# Altium project 0020-03_FFT2G.PrjPcb (part 5 of 5)

## Sheet [3] ADC_INPUT_BIAS.SchDoc: ADC Input Bias
size 299 x 210 mm; SheetNumber: 3; SheetTotal: 21; PageSetup: Record=PageOptions|CenterHorizontal=True|CenterVertical=True|PrintScale=0.94|XCorrection=0.00|YCorrection=0.00|PrintKind=0|BorderSize=5000000|LeftOffset=0|BottomOffset=0|Orientation=2|PaperLength=1000|PaperWidth=1000|Scale=100|PaperSource=15|PrintQuality=600|MediaType=1|DitherType=10|PrintScaleMode=1|PaperKind=A4; Adr1: August Barks gata 6B; Adr2: SE-421 32 Västra Frölunda; Adr3: Sweden; Webpage: www.omnisys.se
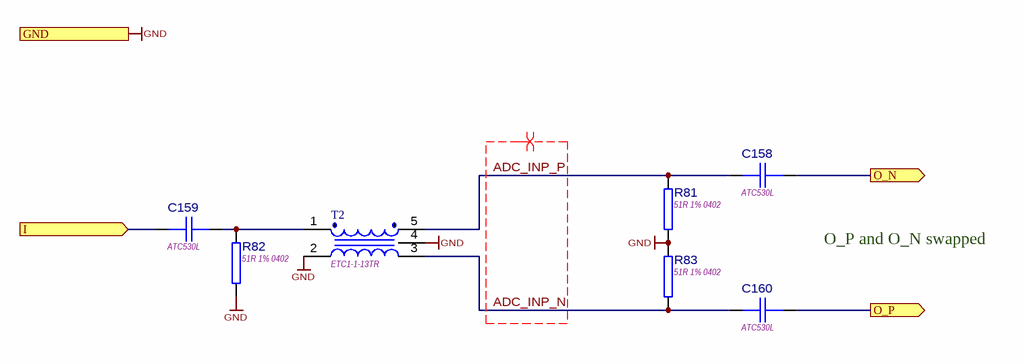
[diagram p13: [3] ADC_INPUT_BIAS.SchDoc]

### Parts
C158  ATC530L  [CAPC1005X06L]
C159  ATC530L  [CAPC1005X06L]
C160  ATC530L  [CAPC1005X06L]
R81  51R 1% 0402  [RESC1005L]
R82  51R 1% 0402  [RESC1005L]
R83  51R 1% 0402  [RESC1005L]
T2  ETC1-1-13TR  [SOTFL50P160X73-3N]

### Ports
GND, I (in), O_N (out), O_P (out)

### Nets
GND: R81.1 R82.2 R83.2 T2.2(Primary) T2.4(NC) ; port GND
ADC_INP_N: C160.2 R83.1 T2.3(Secondary)
ADC_INP_P: C158.2 R81.2 T2.5(Secondary_dot)
NetC158_1: C158.1 ; port O_N
NetC159_1: C159.1 R82.1 T2.1(Primary_dot)
NetC159_2: C159.2 ; port I
NetC160_1: C160.1 ; port O_P

### Layout directives
differential pair; rule Differential Pairs Routing [Pref Gap = 0.2mm    Min Gap  = 0.2mm    Max Gap  = 0.2mmPref Width = 0.3mm    Min Width  = 0.3mm    Max Width  = 0.3mm]; net class DiffPairs_Input: ADC_INP_N, ADC_INP_P

### Notes on the sheet
- O_P and O_N swapped
- August Barks gata 6B
- Omnisys Instruments AB
- Title:
- PCB ASY:
- PCB:
- SVN:
- SVN Folder:
- SE-421 32 Västra Frölunda
- www.omnisys.se
- Page:
- of
- Print date:
- Page size:
- A4
- Information contained in this drawing is confidential. Copying, distributing or use in any matter, other than that specified by OMNISYS INSTRUMENTS AB, is strictly prohibited.

### Library data of the parts
C158-C160 = CMP-0300-000000-2: 100n 16V ±15% 0402 (1005 metric) ATC530L104KT16T; Case-EIA: 0402; Case-Metric: 1005; Dielectric: X7R; OmnisysBuy: False; Maximum working voltage: 16V; Tolerance: ±15%; Technology: SMT
R81-R83 = CMP-1800-001397-4: Thick film Chip Resistor, 0402/1005; Value: 51; Power: 100mW; Maximum working voltage: 50V; Temp. Coefficent: 0.01%; Tolerance: 1%; Case/Package: 0402/1005; Composition: Thick film
T2 = CMP-2000-000004-1: Transformers Audio & Signal 4.5-3000MHz IL 2dB Impedance Ratio 1:1; Max DC Current: 30mA; Power Rating: 250mW; Case/Package: SMD/SMT; Package Quantity: 2000; Termination: SMD/SMT; Depth: 3.81mm; Max Operating Temperature: 85°C; Turns Ratio: 1:1; Length: 3.81mm; Width: 3.81mm; Radiation Hardening: No; Packaging: Tape and Reel; Min Operating Temperature: -40°C; Mount: Surface Mount; Number of Pins: 5; Height: 2.67mm; Lead Free: Contains Lead

## Sheet [4] ADC_DECOUPLING.SchDoc: ADC Decoupling
size 393 x 281 mm; SheetNumber: 4; SheetTotal: 21; PageSetup: Record=PageOptions|CenterHorizontal=True|CenterVertical=True|PrintScale=0.94|XCorrection=0.00|YCorrection=0.00|PrintKind=0|BorderSize=5000000|LeftOffset=0|BottomOffset=0|Orientation=2|PaperLength=1000|PaperWidth=1000|Scale=100|PaperSource=15|PrintQuality=600|MediaType=1|DitherType=10|PrintScaleMode=1|PaperKind=A4; Adr1: August Barks gata 6B; Adr2: SE-421 32 Västra Frölunda; Adr3: Sweden; Webpage: www.omnisys.se
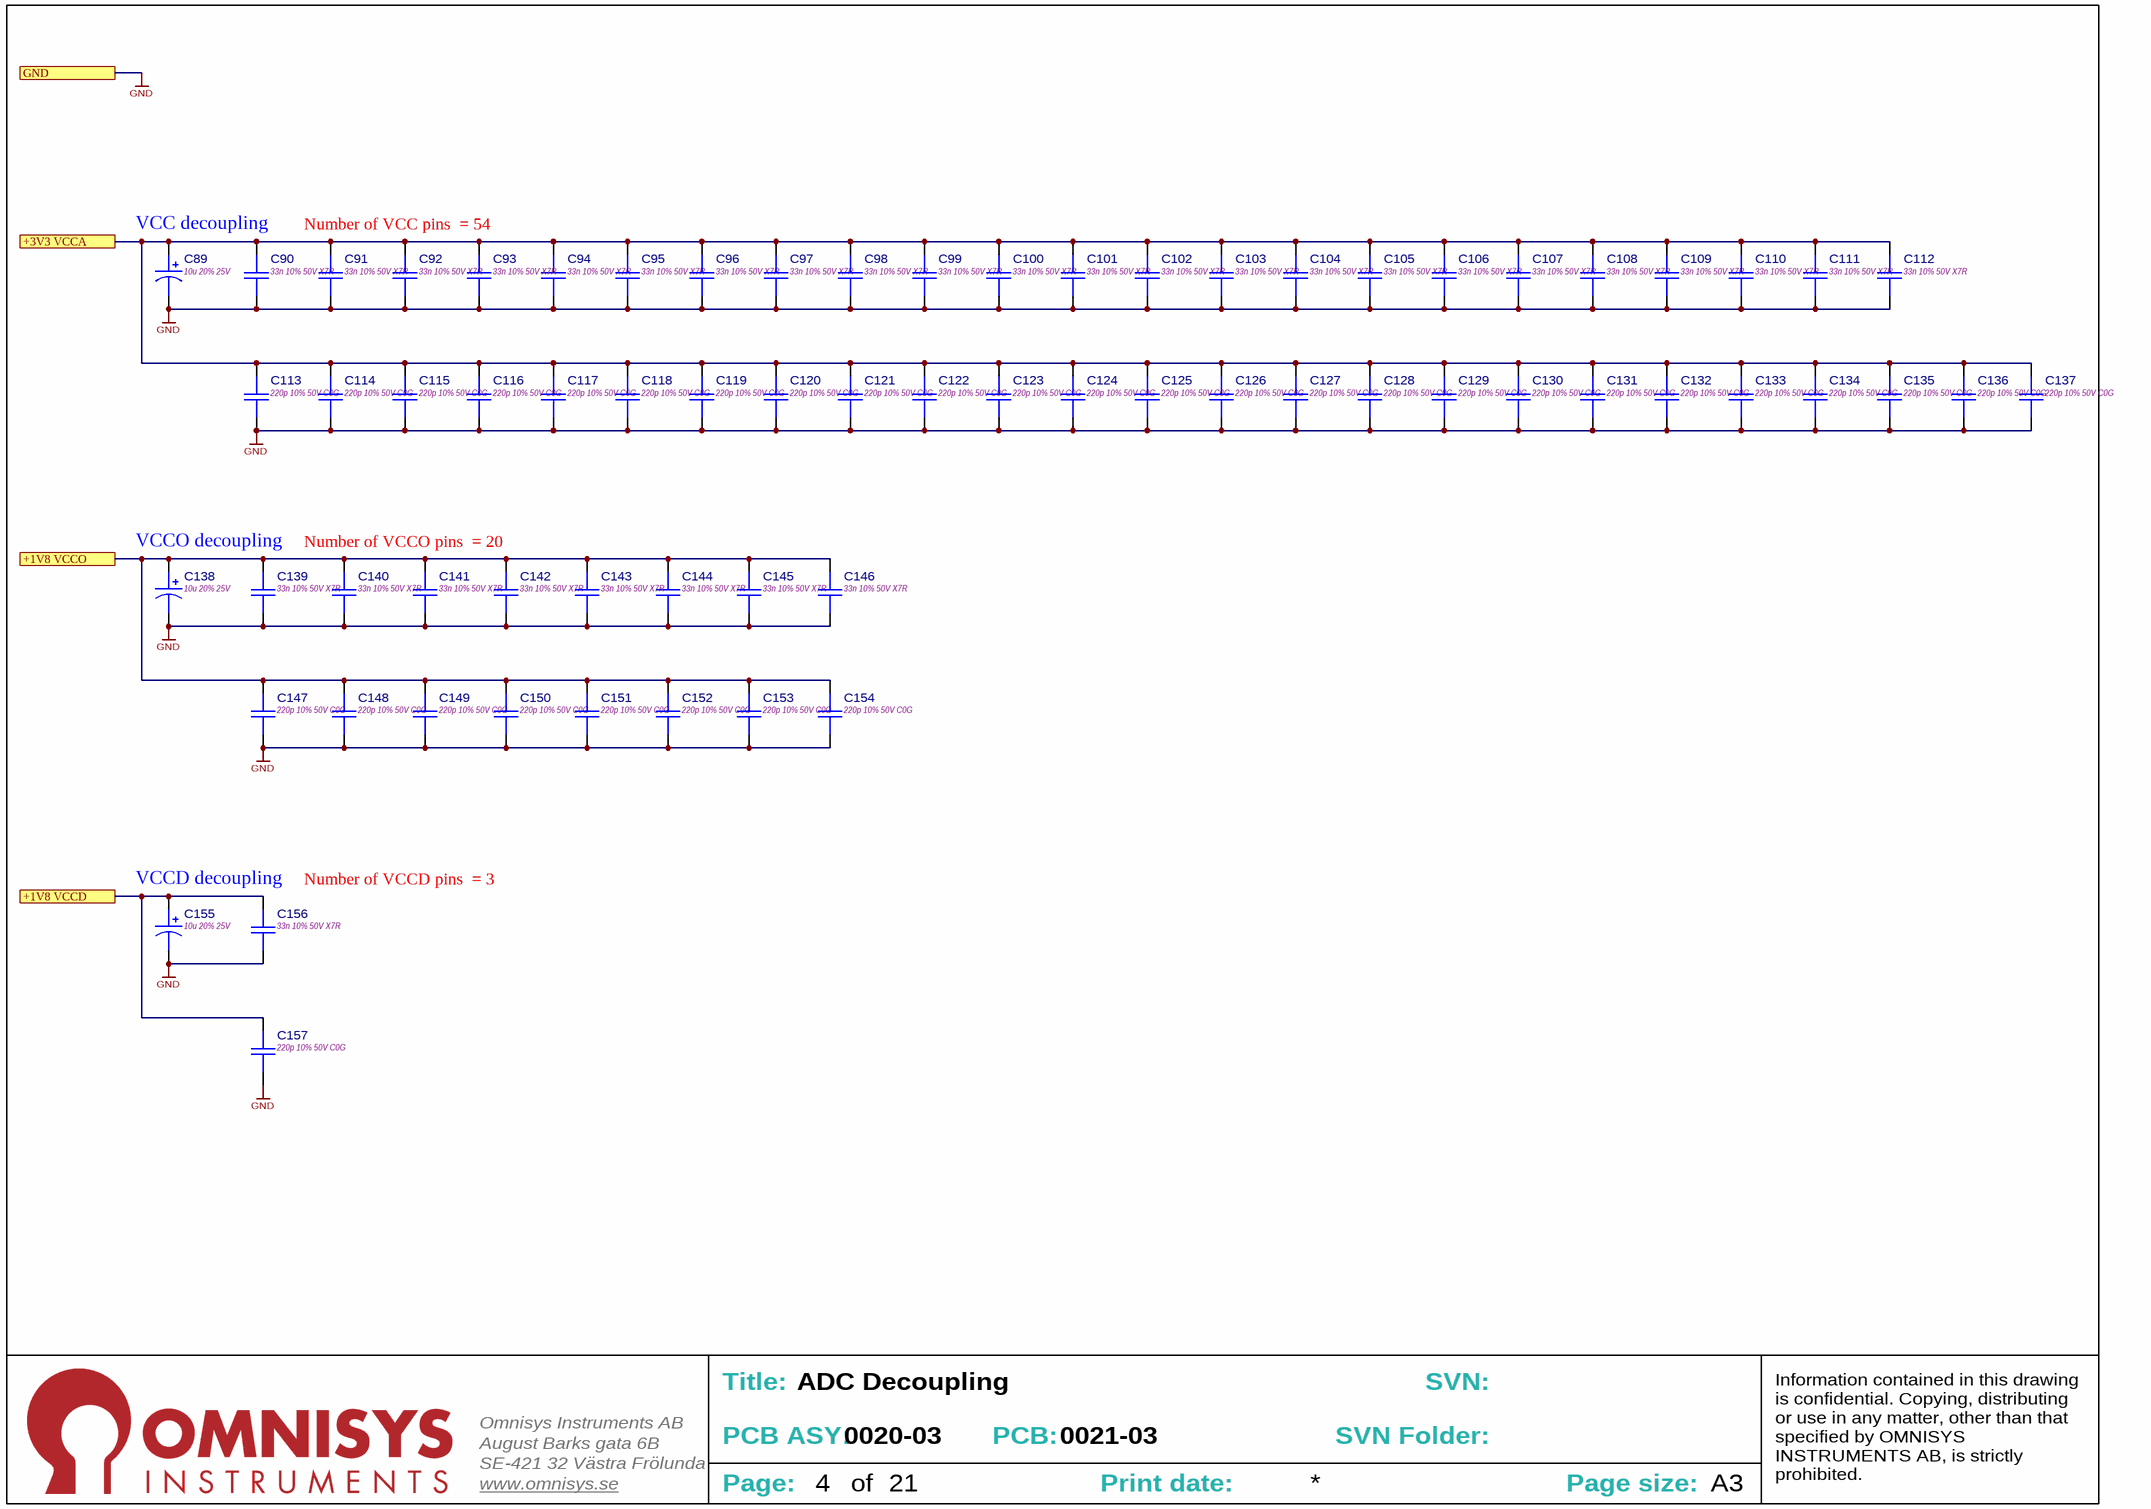
[diagram p14: [4] ADC_DECOUPLING.SchDoc]

### Parts
C89  10u 20% 25V  [CAPMP3528X21N]
C90  33n 10% 50V X7R  [CAPC1005X55L]
C91  33n 10% 50V X7R  [CAPC1005X55L]
C92  33n 10% 50V X7R  [CAPC1005X55L]
C93  33n 10% 50V X7R  [CAPC1005X55L]
C94  33n 10% 50V X7R  [CAPC1005X55L]
C95  33n 10% 50V X7R  [CAPC1005X55L]
C96  33n 10% 50V X7R  [CAPC1005X55L]
C97  33n 10% 50V X7R  [CAPC1005X55L]
C98  33n 10% 50V X7R  [CAPC1005X55L]
C99  33n 10% 50V X7R  [CAPC1005X55L]
C100  33n 10% 50V X7R  [CAPC1005X55L]
C101  33n 10% 50V X7R  [CAPC1005X55L]
C102  33n 10% 50V X7R  [CAPC1005X55L]
C103  33n 10% 50V X7R  [CAPC1005X55L]
C104  33n 10% 50V X7R  [CAPC1005X55L]
C105  33n 10% 50V X7R  [CAPC1005X55L]
C106  33n 10% 50V X7R  [CAPC1005X55L]
C107  33n 10% 50V X7R  [CAPC1005X55L]
C108  33n 10% 50V X7R  [CAPC1005X55L]
C109  33n 10% 50V X7R  [CAPC1005X55L]
C110  33n 10% 50V X7R  [CAPC1005X55L]
C111  33n 10% 50V X7R  [CAPC1005X55L]
C112  33n 10% 50V X7R  [CAPC1005X55L]
C113  220p 10% 50V C0G  [CAPC1005X55L]
C114  220p 10% 50V C0G  [CAPC1005X55L]
C115  220p 10% 50V C0G  [CAPC1005X55L]
C116  220p 10% 50V C0G  [CAPC1005X55L]
C117  220p 10% 50V C0G  [CAPC1005X55L]
C118  220p 10% 50V C0G  [CAPC1005X55L]
C119  220p 10% 50V C0G  [CAPC1005X55L]
C120  220p 10% 50V C0G  [CAPC1005X55L]
C121  220p 10% 50V C0G  [CAPC1005X55L]
C122  220p 10% 50V C0G  [CAPC1005X55L]
C123  220p 10% 50V C0G  [CAPC1005X55L]
C124  220p 10% 50V C0G  [CAPC1005X55L]
C125  220p 10% 50V C0G  [CAPC1005X55L]
C126  220p 10% 50V C0G  [CAPC1005X55L]
C127  220p 10% 50V C0G  [CAPC1005X55L]
C128  220p 10% 50V C0G  [CAPC1005X55L]
C129  220p 10% 50V C0G  [CAPC1005X55L]
C130  220p 10% 50V C0G  [CAPC1005X55L]
C131  220p 10% 50V C0G  [CAPC1005X55L]
C132  220p 10% 50V C0G  [CAPC1005X55L]
C133  220p 10% 50V C0G  [CAPC1005X55L]
C134  220p 10% 50V C0G  [CAPC1005X55L]
C135  220p 10% 50V C0G  [CAPC1005X55L]
C136  220p 10% 50V C0G  [CAPC1005X55L]
C137  220p 10% 50V C0G  [CAPC1005X55L]
C138  10u 20% 25V  [CAPMP3528X21N]
C139  33n 10% 50V X7R  [CAPC1005X55N]
C140  33n 10% 50V X7R  [CAPC1005X55N]
C141  33n 10% 50V X7R  [CAPC1005X55N]
C142  33n 10% 50V X7R  [CAPC1005X55N]
C143  33n 10% 50V X7R  [CAPC1005X55N]
C144  33n 10% 50V X7R  [CAPC1005X55N]
C145  33n 10% 50V X7R  [CAPC1005X55N]
C146  33n 10% 50V X7R  [CAPC1005X55N]
C147  220p 10% 50V C0G  [CAPC1005X55N]
C148  220p 10% 50V C0G  [CAPC1005X55N]
C149  220p 10% 50V C0G  [CAPC1005X55N]
C150  220p 10% 50V C0G  [CAPC1005X55N]
C151  220p 10% 50V C0G  [CAPC1005X55N]
C152  220p 10% 50V C0G  [CAPC1005X55N]
C153  220p 10% 50V C0G  [CAPC1005X55N]
C154  220p 10% 50V C0G  [CAPC1005X55N]
C155  10u 20% 25V  [CAPMP3528X21N]
C156  33n 10% 50V X7R  [CAPC1005X55N]
C157  220p 10% 50V C0G  [CAPC1005X55N]

### Ports
+1V8 VCCD, +1V8 VCCO, +3V3 VCCA, GND

### Nets
GND: C89.2 C90.1 C91.1 C92.1 C93.1 C94.1 C95.1 C96.1 C97.1 C98.1 C99.1 C100.1 C101.1 C102.1 C103.1 C104.1 C105.1 C106.1 C107.1 C108.1 C109.1 C110.1 C111.1 C112.1 C113.1 C114.1 C115.1 C116.1 C117.1 C118.1 C119.1 C120.1 C121.1 C122.1 C123.1 C124.1 C125.1 C126.1 C127.1 C128.1 C129.1 C130.1 C131.1 C132.1 C133.1 C134.1 C135.1 C136.1 C137.1 C138.2 C139.1 C140.1 C141.1 C142.1 C143.1 C144.1 C145.1 C146.1 C147.1 C148.1 C149.1 C150.1 C151.1 C152.1 C153.1 C154.1 C155.2 C156.1 C157.1 ; port GND
NetC89_1: C89.1 C90.2 C91.2 C92.2 C93.2 C94.2 C95.2 C96.2 C97.2 C98.2 C99.2 C100.2 C101.2 C102.2 C103.2 C104.2 C105.2 C106.2 C107.2 C108.2 C109.2 C110.2 C111.2 C112.2 C113.2 C114.2 C115.2 C116.2 C117.2 C118.2 C119.2 C120.2 C121.2 C122.2 C123.2 C124.2 C125.2 C126.2 C127.2 C128.2 C129.2 C130.2 C131.2 C132.2 C133.2 C134.2 C135.2 C136.2 C137.2 ; port +3V3 VCCA
NetC138_1: C138.1 C139.2 C140.2 C141.2 C142.2 C143.2 C144.2 C145.2 C146.2 C147.2 C148.2 C149.2 C150.2 C151.2 C152.2 C153.2 C154.2 ; port +1V8 VCCO
NetC155_1: C155.1 C156.2 C157.2 ; port +1V8 VCCD

### Notes on the sheet
- VCC decoupling
- Number of VCC pins  = 54
- VCCO decoupling
- Number of VCCO pins  = 20
- VCCD decoupling
- (near C156) Number of VCCD pins  = 3
- Title:
- SVN:
- August Barks gata 6B
- SE-421 32 Västra Frölunda
- Omnisys Instruments AB
- PCB ASY:
- PCB:
- SVN Folder:
- www.omnisys.se
- Page:
- of
- Print date:
- Page size:
- A3
- Information contained in this drawing is confidential. Copying, distributing or use in any matter, other than that specified by OMNISYS INSTRUMENTS AB, is strictly prohibited.

### Library data of the parts
C89 C138 C155 = CMP-0300-000090-5: Standard tantalum capacitor, 3528/Case B; DCL: 2.5A; DF: 6%; ESR: 2.5; Capacitance: 10µF; Tolerance: 20%; Rated Voltage: 25V; Case/Package: 3528
C90-C112 C139-C146 C156 = CMP-0300-002958-5: Ceramic Chip Capacitor, 0402/1005; Capacitance: 33nF; Package: 0402/1005; Temperature Charateristics: X7R; Tolerance: 10%; Thickness: 550µm; Rated Voltage: 50V
C113-C137 C147-C154 C157 = CMP-0300-002795-5: Ceramic Chip Capacitor, 0402/1005; Capacitance: 220pF; Package: 0402/1005; Temperature Charateristics: C0G; Tolerance: 10%; Thickness: 550µm; Rated Voltage: 50V

## Sheet [5] ADC_CURRENT_PUMP.SchDoc: ADC Current pump
size 393 x 281 mm; SheetNumber: 5; SheetTotal: 21; PageSetup: Record=PageOptions|CenterHorizontal=True|CenterVertical=True|PrintScale=0.94|XCorrection=0.00|YCorrection=0.00|PrintKind=0|BorderSize=5000000|LeftOffset=0|BottomOffset=0|Orientation=2|PaperLength=1000|PaperWidth=1000|Scale=100|PaperSource=15|PrintQuality=600|MediaType=1|DitherType=10|PrintScaleMode=1|PaperKind=A4; Adr1: August Barks gata 6B; Adr2: SE-421 32 Västra Frölunda; Adr3: Sweden; Webpage: www.omnisys.se
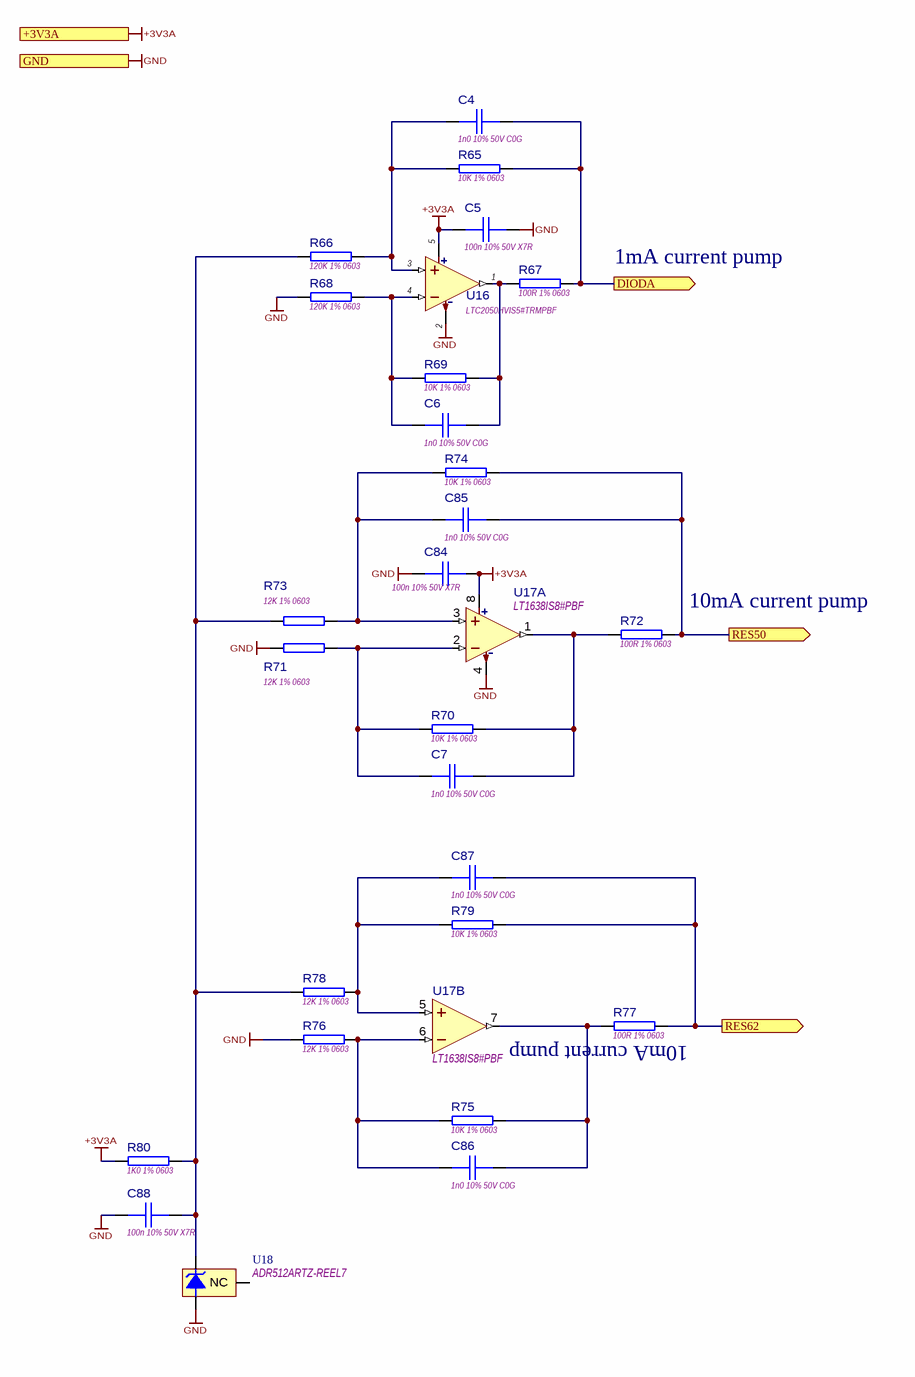
[diagram p15: [5] ADC_CURRENT_PUMP.SchDoc]

### Parts
(Parts that share a designator on the sheet are numbered #1, #2 ... from top to bottom, then left to right.)
C4  1n0 10% 50V C0G  [CAPC1608X90N]
C5  100n 10% 50V X7R  [CAPC1608X90N]
C6  1n0 10% 50V C0G  [CAPC1608X90N]
C7  1n0 10% 50V C0G  [CAPC1608X90N]
C84  100n 10% 50V X7R  [CAPC1608X90N]
C85  1n0 10% 50V C0G  [CAPC1608X90N]
C86  1n0 10% 50V C0G  [CAPC1608X90N]
C87  1n0 10% 50V C0G  [CAPC1608X90N]
C88  100n 10% 50V X7R  [CAPC1608X90N]
R65#2  10K 1% 0603  [RESC1608N]
R66  120K 1% 0603  [RESC1608N]
R67  100R 1% 0603  [RESC1608N]
R68  120K 1% 0603  [RESC1608N]
R69#2  10K 1% 0603  [RESC1608N]
R70  10K 1% 0603  [RESC1608N]
R71  12K 1% 0603  [RESC1608N]
R72  100R 1% 0603  [RESC1608N]
R73  12K 1% 0603  [RESC1608N]
R74  10K 1% 0603  [RESC1608N]
R75  10K 1% 0603  [RESC1608N]
R76  12K 1% 0603  [RESC1608N]
R77  100R 1% 0603  [RESC1608N]
R78  12K 1% 0603  [RESC1608N]
R79  10K 1% 0603  [RESC1608N]
R80  1K0 1% 0603  [RESC1608N]
U16  LTC2050HVIS5#TRMPBF  [SOT95P280X100-5N]
U17  LT1638IS8#PBF  [SOIC127P600X175-8N]  (parts A,B of 2)
U18  ADR512ARTZ-REEL7  [SOT95P230X110-3N]

### Ports
+3V3A, DIODA (out), GND, RES50 (out), RES62 (out)

### Nets
+3V3A: C5.2 C84.2 R80.2 U16.5(+V) U17.8(+V) ; port +3V3A
GND: C5.1 C84.1 C88.1 R68.1 R71.1 R76.1 U16.2(-V) U17.4(-V) U18.2(-V) ; port GND
NetC4_1: C4.1 R65#2.2 R67.1 ; port DIODA
NetC4_2: C4.2 R65#2.1 R66.2 U16.3(+IN)
NetC6_1: C6.1 R67.2 R69#2.2 U16.1(OUT)
NetC6_2: C6.2 R68.2 R69#2.1 U16.4(-IN)
NetC7_1: C7.1 R70.1 R72.2 U17.1(OutA)
NetC7_2: C7.2 R70.2 R71.2 U17.2(-InA)
NetC85_1: C85.1 R72.1 R74.2 ; port RES50
NetC85_2: C85.2 R73.2 R74.1 U17.3(+InA)
NetC86_1: C86.1 R75.1 R77.2 U17.7(OutB)
NetC86_2: C86.2 R75.2 R76.2 U17.6(-InB)
NetC87_1: C87.1 R77.1 R79.1 ; port RES62
NetC87_2: C87.2 R78.2 R79.2 U17.5(+InB)
NetC88_2: C88.2 R66.1 R73.1 R78.1 R80.1 U18.1(+V)

Not connected (* = marked no-connect by the designer): U18 3(NC)

### Notes on the sheet
- 1mA current pump
- (near R72) 10mA current pump
- (near R77) 10mA current pump
- Title:
- SVN:
- August Barks gata 6B
- SE-421 32 Västra Frölunda
- Omnisys Instruments AB
- PCB ASY:
- PCB:
- SVN Folder:
- www.omnisys.se
- Page:
- of
- Print date:
- Page size:
- A3
- Information contained in this drawing is confidential. Copying, distributing or use in any matter, other than that specified by OMNISYS INSTRUMENTS AB, is strictly prohibited.

### Library data of the parts
C4 C6 C7 C85-C87 = CMP-0300-002463-5: Ceramic Chip Capacitor, 0603/1608; Tolerance: 5%; Capacitance: 1nF; Package: 1608/0603; Temperature Charateristics: C0G; Rated Voltage: 50V; Thickness: 900µm; Weight: 9mg
C5 C84 C88 = CMP-0300-002665-6: Ceramic Chip Capacitor, 0603/1608; Capacitance: 100nF; Package: 1608/0603; Temperature Charateristics: X7R; Tolerance: 10%; Rated Voltage: 50V; Thickness: 900µm; Weight: 9mg
R65#2 R69#2 R70 R74 R75 R79 = CMP-1800-002045-5: Thick film Chip Resistor, 0603/1608; Power: 100mW; Maximum working voltage: 75V; Temp. Coefficent: 0.01%; Value: 10k; Tolerance: 1%; Case/Package: 0603/1608; Composition: Thick film
R66 R68 = CMP-1800-002071-5: Thick film Chip Resistor, 0603/1608; Power: 100mW; Maximum working voltage: 75V; Temp. Coefficent: 0.01%; Value: 120k; Tolerance: 1%; Case/Package: 0603/1608; Composition: Thick film
R67 R72 R77 = CMP-1800-001998-5: Thick film Chip Resistor, 0603/1608; Value: 100; Power: 100mW; Maximum working voltage: 75V; Temp. Coefficent: 0.01%; Tolerance: 1%; Case/Package: 0603/1608; Composition: Thick film
R71 R73 R76 R78 = CMP-1800-002047-5: Thick film Chip Resistor, 0603/1608; Power: 100mW; Maximum working voltage: 75V; Temp. Coefficent: 0.01%; Value: 12k; Tolerance: 1%; Case/Package: 0603/1608; Composition: Thick film
R80 = CMP-1800-002021-5: Thick film Chip Resistor, 0603/1608; Maximum working voltage: 75V; Temp. Coefficent: 0.01%; Value: 1k; Power: 100mW; Tolerance: 1%; Case/Package: 0603/1608; Composition: Thick film
U16 = CMP-2100-000593-1: Zero-Drift Operational Amplifiers in SOT-23; Common Mode Rejection Ratio: 120dB; Gain Bandwidth Product: 3MHz; Input Bias Current: 25pA; Input Offset Voltage (Vos): 0.5uV; Max Dual Supply Voltage: 5.5V; Max Frequency: 7.5kHz; Max Supply Voltage: 11V; Min Dual Supply Voltage: 1.35V; Min Supply Voltage: 2.7V; Number of Channels: 1; Operating Supply Current: 1mA; Slew Rate: 2V/µs; Voltage Gain: 140dB; Case/Package: SOT-23-5; Height: 0.9mm; Lead Free: Lead Free; Length: 2.9mm; Max Operating Temperature: 85°C; Min Operating Temperature: -40°C; Nominal Gain Bandwidth Product: 3MHz; Number of Circuits: 1; Number of Elements: 1; Number of Pins: 5; Package Quantity: 1; Packaging: Tape and Reel; Power Supply Rejection Ratio (PSRR): 120dB; Unity Gain Bandwidth Product: 3MHz; Width: 1.75mm
U17 = CMP-2100-000588-1: 215MHz, Rail-to-Rail Output, 1.1nV/√Hz, 3.5mA Op Amp; Bandwidth: 1.2MHz; Common Mode Rejection Ratio: 80dB; Dual Supply Voltage: 3V; Input Bias Current: 20nA; Input Offset Voltage (Vos): 600uV; Max Dual Supply Voltage: 22V; Max Supply Current: 460uA; Max Supply Voltage: 44V; Min Dual Supply Voltage: 1.25V; Min Supply Voltage: 2.2V; Number of Amplifiers: 2; Operating Supply Current: 205uA; Output Current per Channel: 40mA; Power Supply Rejection Ratio (PSRR): 90dB; Slew Rate: 0.38V/µs; Unity Gain Bandwidth Product: 1.075MHz; Voltage Gain: 123.52dB; Case/Package: SOIC; Gain Bandwidth Product: 1.2MHz; Height: 1.5mm; Lead Free: Lead Free; Length: 5mm; Max Operating Temperature: 85°C; Min Operating Temperature: -40°C; Nominal Gain Bandwidth Product: 1.2MHz; Number of Channels: 2; Number of Circuits: 2; Number of Elements: 2; Number of Pins: 8; Operating Supply Voltage: 3V; Package Quantity: 100; Packaging: Rail/Tube; REACH SVHC: No SVHC; Width: 3.99mm
U18 = CMP-2100-000594-1: 1.2 V Precision Low Noise Shunt Voltage Reference; Max Output Current: 10mA; Max Output Voltage: 1.2V; Temperature Coefficient: 60ppm/°C; Tolerance: 0.3%; Cathode Current: 100uA; Output Type: Fixed; Case/Package: SOT; Height: 1.02mm; Lead Free: Contains Lead; Length: 3.04mm; Max Operating Temperature: 85°C; Min Operating Temperature: -40°C; Number of Pins: 3; Output Current: 10mA; Output Voltage: 1.2V; Package Quantity: 1; Packaging: Tape and Reel; Radiation Hardening: No; REACH SVHC: No SVHC; Reference Type: Shunt; Reference Voltage: 1.2V; Width: 1.4mm; Min Output Voltage: 1.2V

## Nets that join several sheets
+1V0: [7] ETH (5 pins), [16] POWER (TP14.1), POWER/Ch_A 1.0V (15 pins), POWER/Ch_B 2.5V (R130.2.2)
+2V3: [17] POWER-FILTER_LDO (C68.1 C69.1 R44.1 U12.2), POWER/Ch_C 2.3V (15 pins), POWER/Ch_D 3.8V (R130.4.2)
+2V5: [1] 0020-03_FFT2G - Top (J1.2 J1.14), [6] CLOCK (C36.2 U5.14), [9] FPGA_ADC_N (8 pins), [12] FPGA_MONITOR (R121.1), [11] FPGA_CONFIG (19 pins), [7] ETH (13 pins), [16] POWER (TP15.1), POWER/Ch_B 2.5V (15 pins), POWER/Ch_C 2.3V (R130.3.2)
+3V3: [6] CLOCK (30 pins), [21] USB (22 pins), [11] FPGA_CONFIG (11 pins), [16] POWER (C203.2 R136.2 U32.5), [17] POWER-FILTER_LDO (F8.2 TP12.1)
GND: [1] 0020-03_FFT2G - Top (39 pins), [6] CLOCK (51 pins), [21] USB (30 pins), [9] FPGA_ADC_N (8 pins), [12] FPGA_MONITOR (R120.1 U19.B11), [15] FPGA_UNUSED (74 pins), [11] FPGA_CONFIG (30 pins), [7] ETH (18 pins), [16] POWER (13 pins), POWER/Ch_A 1.0V (31 pins), [17] POWER-FILTER_LDO (30 pins), POWER/Ch_B 2.5V (29 pins), POWER/Ch_C 2.3V (29 pins), POWER/Ch_D 3.8V (29 pins)
+3.8V: [17] POWER-FILTER_LDO (8 pins), POWER/Ch_D 3.8V (15 pins)
CLK1: [16] POWER (P22.1), POWER/Ch_A 1.0V (U30.1.F2)
CLK2: [16] POWER (P23.1), POWER/Ch_B 2.5V (U30.2.F2)
CLK3: [16] POWER (P24.1), POWER/Ch_C 2.3V (U30.3.F2)
ETH_ACT: [1] 0020-03_FFT2G - Top (R2.2), [7] ETH (U13.39)
ETH_D0_N: [1] 0020-03_FFT2G - Top (J1.4), [7] ETH (U13.11)
ETH_D0_P: [1] 0020-03_FFT2G - Top (J1.3), [7] ETH (U13.12)
ETH_D1_N: [1] 0020-03_FFT2G - Top (J1.6), [7] ETH (U13.9)
ETH_D1_P: [1] 0020-03_FFT2G - Top (J1.5), [7] ETH (U13.10)
ETH_D2_N: [1] 0020-03_FFT2G - Top (J1.8), [7] ETH (U13.6)
ETH_D2_P: [1] 0020-03_FFT2G - Top (J1.7), [7] ETH (U13.7)
ETH_D3_N: [1] 0020-03_FFT2G - Top (J1.10), [7] ETH (U13.3)
ETH_D3_P: [1] 0020-03_FFT2G - Top (J1.9), [7] ETH (U13.4)
ETH_SPD: [1] 0020-03_FFT2G - Top (R1.2), [7] ETH (U13.38)
FPGA_CLK_N: [6] CLOCK (C27.1), [12] FPGA_MONITOR (R122.1 U19.E11)
FPGA_CLK_P: [6] CLOCK (C24.1), [12] FPGA_MONITOR (R122.2 U19.D11)
JTAG.TCK: [21] USB (U6.38), [11] FPGA_CONFIG (U20.5)
JTAG.TDI: [21] USB (U6.39), [11] FPGA_CONFIG (U20.2)
JTAG.TDO: [21] USB (U6.40), [11] FPGA_CONFIG (U22.4)
JTAG.TMS: [21] USB (U6.41), [11] FPGA_CONFIG (U20.9)
NetC34_1: [1] 0020-03_FFT2G - Top (J15.1), [6] CLOCK (C34.1)
NetP22_2: [16] POWER (P22.2), POWER/Ch_B 2.5V (U30.2.D2)
NetP23_2: [16] POWER (P23.2), POWER/Ch_C 2.3V (U30.3.D2)
NetP24_2: [16] POWER (P24.2), POWER/Ch_D 3.8V (U30.4.D2)
NetP25_2: [16] POWER (P25.2), POWER/Ch_A 1.0V (U30.1.D2)
TEMP_PWR: [12] FPGA_MONITOR (U19.E13), [16] POWER (C202.1 R65#1.2 R135.1), POWER/Ch_A 1.0V (J14.1.1 U30.1.A6)
TEMP_PWR_rtn: [12] FPGA_MONITOR (U19.F13), [16] POWER (P21.1)
UIN: [1] 0020-03_FFT2G - Top (J22.1), [16] POWER (C183.1 C185.1 L8.1)
UIN_F: [16] POWER (5 pins), POWER/Ch_A 1.0V (8 pins), POWER/Ch_B 2.5V (8 pins), POWER/Ch_C 2.3V (8 pins), POWER/Ch_D 3.8V (8 pins)
USB_D_N: [1] 0020-03_FFT2G - Top (J10.A7 J10.B7), [21] USB (U6.7)
USB_D_P: [1] 0020-03_FFT2G - Top (J10.A6 J10.B6), [21] USB (U6.8)
USB_PWREN: [21] USB (Q3.1 R27.1 U6.60), [11] FPGA_CONFIG (6 pins)

## Assembly variants
Design Variant: not fitted C72 C73 C74 C75 C76 C77 C78 C79 C80 C81 C82 C83 F3 F12 F13 J1 J2 J3 J4 J5 J6 J7 J8 J9 J12.1 J12.2 J12.3 J12.4 J13.1 J13.2 J13.3 J13.4 J14.1 J14.2 J14.3 J14.4 J15 J16.1 J16.2 J16.3 J16.4 J17 J18 J19 J20.1 J20.2 J20.3 J20.4 J21.1 J21.2 J21.3 J21.4 J22 J23 P1 P2 P3 P4 P5 P6 P7 P8 P9 P10 P11 P12 P13 P14 P15 P16 P17 P18 P19 P20 P21 P22 P23 P24 P25 P26 P27 P28 P29 PCB1 PCB2 R1 R2 R3 R31 R35 R38 R49 R50 R51 R52 R53 R54 R55 R56 R57 R84 R85 R86 R87 R88 R89 R90 R91 R130.1 R130.2 R130.3 R130.4 R131.1 R131.2 R131.3 R131.4 R138 R139 U13 X3; alternate parts C200.2 -> CMP-0300-002446-6, C201.2 -> CMP-0300-002453-6, R132.2 -> CMP-1800-002039-5, R132.1 -> CMP-1800-002412-4, C200.3 -> CMP-0300-002446-6, C201.3 -> CMP-0300-002453-6, R132.3 -> CMP-1800-002042-5, C200.4 -> CMP-0300-002445-6, C201.4 -> CMP-0300-002450-6, R132.4 -> CMP-1800-002047-5, C200.1 -> CMP-0300-002447-6, C201.1 -> CMP-0300-002454-6, R48.2 -> CMP-1800-002464-4, R48.3 -> CMP-1800-002469-4, R48.4 -> CMP-1800-002442-4, C199.4 -> CMP-0300-002107-6